# Altium schematic sheet Esp32.SchDoc: ESP 32
size A4; SheetNumber: 2; SheetTotal: 7
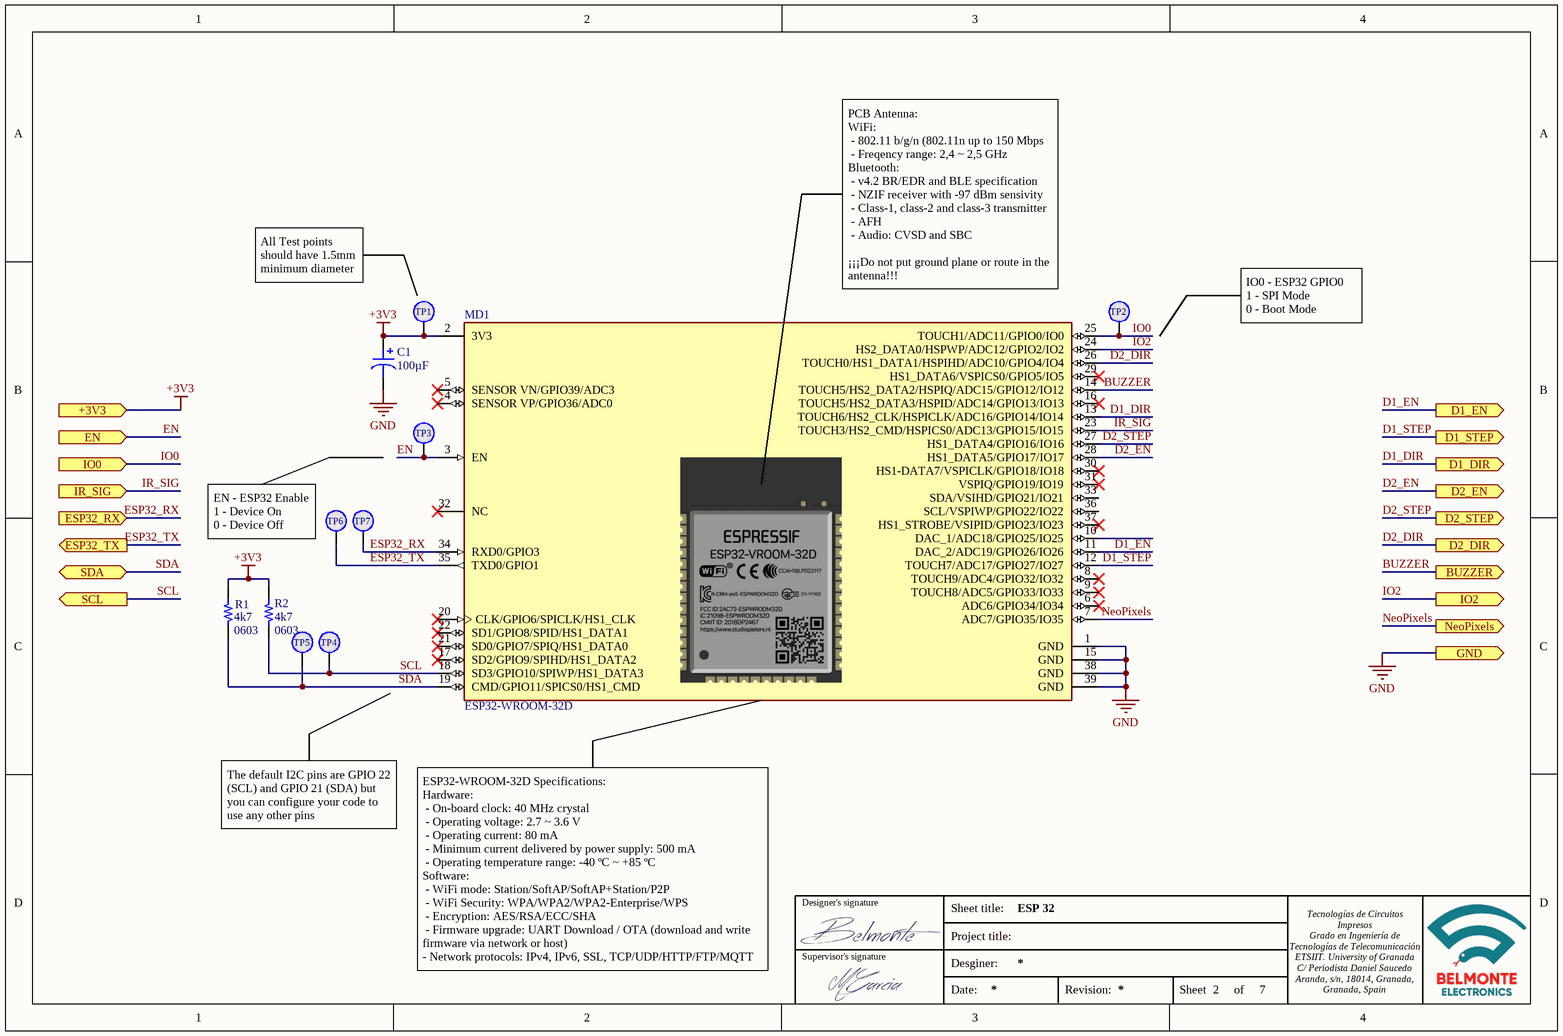
[diagram p0: Esp32.SchDoc]

## Parts
C1  Capacitance: 100µF  [CAP ALSMD POLY 5.3MM H6.1MM]  (hidden comment: ALUM 100uF)
MD1  ESP32-WROOM-32D  [FP-ESP32-WROOM-32D-MFG]
R1  4k7  Size: 0603  [RESC1608X55X30NL15T15]
R2  4k7  Size: 0603  [RESC1608X55X30NL15T15]
TP1  Test point  [TestPoint]  (value not drawn)  (no BOM)
TP2  Test point  [TestPoint]  (value not drawn)  (no BOM)
TP3  Test point  [TestPoint]  (value not drawn)  (no BOM)
TP4  Test point  [TestPoint]  (value not drawn)  (no BOM)
TP5  Test point  [TestPoint]  (value not drawn)  (no BOM)
TP6  Test point  [TestPoint]  (value not drawn)  (no BOM)
TP7  Test point  [TestPoint]  (value not drawn)  (no BOM)

## Ports
+3V3 (in), BUZZER (out), D1_DIR (out), D1_EN (out), D1_STEP (out), D2_DIR (out), D2_EN (out), D2_STEP (out), EN (in), ESP32_RX (in), ESP32_TX (out), GND (out), IO0 (in), IO2 (out), IR_SIG (in), NeoPixels (out), SCL (out), SDA (bidir)

## Nets
+3V3: C1.1 MD1.2(3V3) R1.1 R2.1 TP1.1 ; port +3V3
GND: C1.2 MD1.1(GND) MD1.15(GND) MD1.38(GND) MD1.39(GND) ; port GND
BUZZER: MD1.14(TOUCH5/HS2_DATA2/HSPIQ/ADC15/GPIO12/IO12) ; port BUZZER
D1_DIR: MD1.13(TOUCH6/HS2_CLK/HSPICLK/ADC16/GPIO14/IO14) ; port D1_DIR
D1_EN: MD1.11(DAC_2/ADC19/GPIO26/IO26) ; port D1_EN
D1_STEP: MD1.12(TOUCH7/ADC17/GPIO27/IO27) ; port D1_STEP
D2_DIR: MD1.26(TOUCH0/HS1_DATA1/HSPIHD/ADC10/GPIO4/IO4) ; port D2_DIR
D2_EN: MD1.28(HS1_DATA5/GPIO17/IO17) ; port D2_EN
D2_STEP: MD1.27(HS1_DATA4/GPIO16/IO16) ; port D2_STEP
EN: MD1.3(EN) TP3.1 ; port EN
ESP32_RX: MD1.34(RXD0/GPIO3) TP7.1 ; port ESP32_RX
ESP32_TX: MD1.35(TXD0/GPIO1) TP6.1 ; port ESP32_TX
IO0: MD1.25(TOUCH1/ADC11/GPIO0/IO0) TP2.1 ; port IO0
IO2: MD1.24(HS2_DATA0/HSPWP/ADC12/GPIO2/IO2) ; port IO2
IR_SIG: MD1.23(TOUCH3/HS2_CMD/HSPICS0/ADC13/GPIO15/IO15) ; port IR_SIG
NeoPixels: MD1.7(ADC7/GPIO35/IO35) ; port NeoPixels
SCL: MD1.18(SD3/GPIO10/SPIWP/HS1_DATA3) R2.2 TP4.1 ; port SCL
SDA: MD1.19(CMD/GPIO11/SPICS0/HS1_CMD) R1.2 TP5.1 ; port SDA

Not connected (* = marked no-connect by the designer): MD1 4(SENSOR_VP/GPIO36/ADC0)* 5(SENSOR_VN/GPIO39/ADC3)* 6(ADC6/GPIO34/IO34)* 8(TOUCH9/ADC4/GPIO32/IO32)* 9(TOUCH8/ADC5/GPIO33/IO33)* 10(DAC_1/ADC18/GPIO25/IO25) 16(TOUCH5/HS2_DATA3/HSPID/ADC14/GPIO13/IO13)* 17(SD2/GPIO9/SPIHD/HS1_DATA2)* 20(CLK/GPIO6/SPICLK/HS1_CLK)* 21(SD0/GPIO7/SPIQ/HS1_DATA0)* 22(SD1/GPIO8/SPID/HS1_DATA1)* 29(HS1_DATA6/VSPICS0/GPIO5/IO5)* 30(HS1-DATA7/VSPICLK/GPIO18/IO18)* 31(VSPIQ/GPIO19/IO19)* 32(NC)* 33(SDA/VSIHD/GPIO21/IO21) 36(SCL/VSPIWP/GPIO22/IO22) 37(HS1_STROBE/VSIPID/GPIO23/IO23)*

## Notes on the sheet
- All Test points should have 1.5mm minimum diameter
- PCB Antenna:
  WiFi:
  - 802.11 b/g/n (802.11n up to 150 Mbps
  - Freqency range: 2,4 ~ 2,5 GHz
  Bluetooth:
  - v4.2 BR/EDR and BLE specification
  - NZIF receiver with -97 dBm sensivity
  - Class-1, class-2 and class-3 transmitter
  - AFH
  - Audio: CVSD and SBC
  ¡¡¡Do not put ground plane or route in the antenna!!!
- IO0 - ESP32 GPIO0
  1 - SPI Mode
  0 - Boot Mode
- (near TP6) EN - ESP32 Enable
  1 - Device On
  0 - Device Off
- The default I2C pins are GPIO 22 (SCL) and GPIO 21 (SDA) but you can configure your code to use any other pins
- ESP32-WROOM-32D Specifications:
  Hardware:
  - On-board clock: 40 MHz crystal
  - Operating voltage: 2.7 ~ 3.6 V
  - Operating current: 80 mA
  - Minimum current delivered by power supply: 500 mA
  - Operating temperature range: -40 ºC ~ +85 ºC
  Software:
  - WiFi mode: Station/SoftAP/SoftAP+Station/P2P
  - WiFi Security: WPA/WPA2/WPA2-Enterprise/WPS
  - Encryption: AES/RSA/ECC/SHA
  - Firmware upgrade: UART Download / OTA (download and write firmware via network or host)
  - Network protocols: IPv4, IPv6, SSL, TCP/UDP/HTTP/FTP/MQTT
- Designer's signature
- Sheet title:
- Supervisor's signature
- Project title:
- Desginer:
- Date:
- Revision:
- Sheet
- of
- Tecnologías de Circuitos Impresos
  Grado en Ingeniería de Tecnologías de Telecomunicación
  ETSIIT. University of Granada
  C/ Periodista Daniel Saucedo Aranda, s/n, 18014, Granada, Granada, Spain

## Library data of the parts
C1 = MAL218497352E3: CAP ALUM 100UF 4V 2000H; Manufacturer: Vishay Beyschlag/Draloric/BC Components; ESR (Equivalent Series Resistance): 25mOhm; Lifetime @ Temp.: 2000 Hrs @ 105°C; Ripple Current @ High Frequency: 2.31A @ 100kHz; Ripple Current @ Low Frequency: 115.5mA @ 120Hz; Surface Mount Land Size: 0.209" L x 0.209" W (5.30mm x 5.30mm); Tolerance: ±20%; Type: Polymer; Value: 100 µF; Part Number: MAL218497352E3; Applications: General Purpose; ComponentLink2Description: DigiKey Link; ComponentLink2URL: http://digikey.com/product-detail/en/vishay-beyschlag-draloric-bc-components/MAL218497352E3/56-MAL218497352E3-ND/12814066; Device Package: Radial, Can - SMD; Height - Seated (Max): 0.240" (6.10mm); LastUpdated: 08/30/2020 21:02:23; Lifecycle Status: Active; Minimum Order: 5000; Mounting Type: Surface Mount; Packaging: Box; PartId: 2781; Price: 0.27; Series: 184 CPNS; Size / Dimension: 0.197" Dia (5.00mm); Supplier 1: DigiKey; Supplier Part Number 1: 56-MAL218497352E3-ND; Category: Cap; Size: 0603
MD1 = CMP-194065-000003-1: WIFI MODULE 32MBITS SPI FLASH; Manufacturer: Espressif Systems; Max Supply Voltage: 3.6V; Nominal Supply Current: 500mA; Max Frequency: 2484MHz; Number Of Adc Channels: 16; Number Of Gpio: 32; Interface: I2C,SPI,UART,Ethernet,I2S,Other; Data Rate: 150Mbits/s; Min Supply Voltage: 3V; Bandwidth: 72MHz; Sensitivity: -98dBm; Octopart: https://octopart.com/esp32-wroom-32d-espressif+systems-91040050; Package: ESP32-WROOM-32D; ComponentLink2URL: https://www.espressif.com/sites/default/files/documentation/esp32-wroom-32d_esp32-wroom-32u_datasheet_en.pdf; Lead Free: Yes; Category: Chip; Mouser Description: Wi-Fi/BT BLE Module ESP32-D0WD, SPI Flash, UART, P; Device Class L1: Integrated Circuits (ICs); RoHS: TRUE; Temperature Range Low: -40°C; ComponentLink2Description: Datasheet; Digikey Description: WIFI MODULE 32MBITS SPI FLASH; Height: 3.2mm; Temperature: -40°C to +85°C; Manufacturer Part Number: ESP32-WROOM-32D; Device Class L3: Transceivers; Device Class L2: RF Semiconductors and Devices; Temperature Range High: +85°C; Automotive: No
R1 R2 = CMP-1012-00586-3: Precision Thick Film Chip Resistor, 4.7 KOhm, +/- 1%, -55 to 155 degC, 0603 (1608 Metric), RoHS, Tape and Reel; Manufacturer: Vishay Dale; Manufacturer Part Number: CRCW06034K70FKEB; Voltage Rating: 50 V; Elements: 4; Case\Package: 1205; Tolerance: 5%; Power Rating: 250 mW; Value: 4.7 kΩ; Max Operating Temperature: 125 degC; REACH SVHC: No SVHC; Width: 0.063 inch; Length: 0.126 inch; Mount: Surface Mount; Package Quantity: 1; DatasheetVersion: Apr-15; ComponentLink1Description: Manufacturer URL; Min Operating Temperature: -55 degC; Packaging: Tape and Reel; Radiation Hardening: No; ComponentLink2URL: http://industrial.panasonic.com/cdbs/www-data/pdf/RDA0000/AOA0000C86.pdf; Case Code (Metric): 3216; Pins: 8; Case Code (Imperial): 1206; Type (Resistor): Thick Film; RoHSCompliant: true; ComponentLink2Description: Datasheet; PackageDescription: 2-Pin Surface Mount Device, Body 1.6 x 0.85 mm; ComponentLink1URL: http://www.panasonic.com/; Height: 0.024 inch; Resistance: 4k7; Category: Res
TP1-TP7 = TestPoint